# EAGLE schematic M3 (SN755410) (EAGLE 6.2)
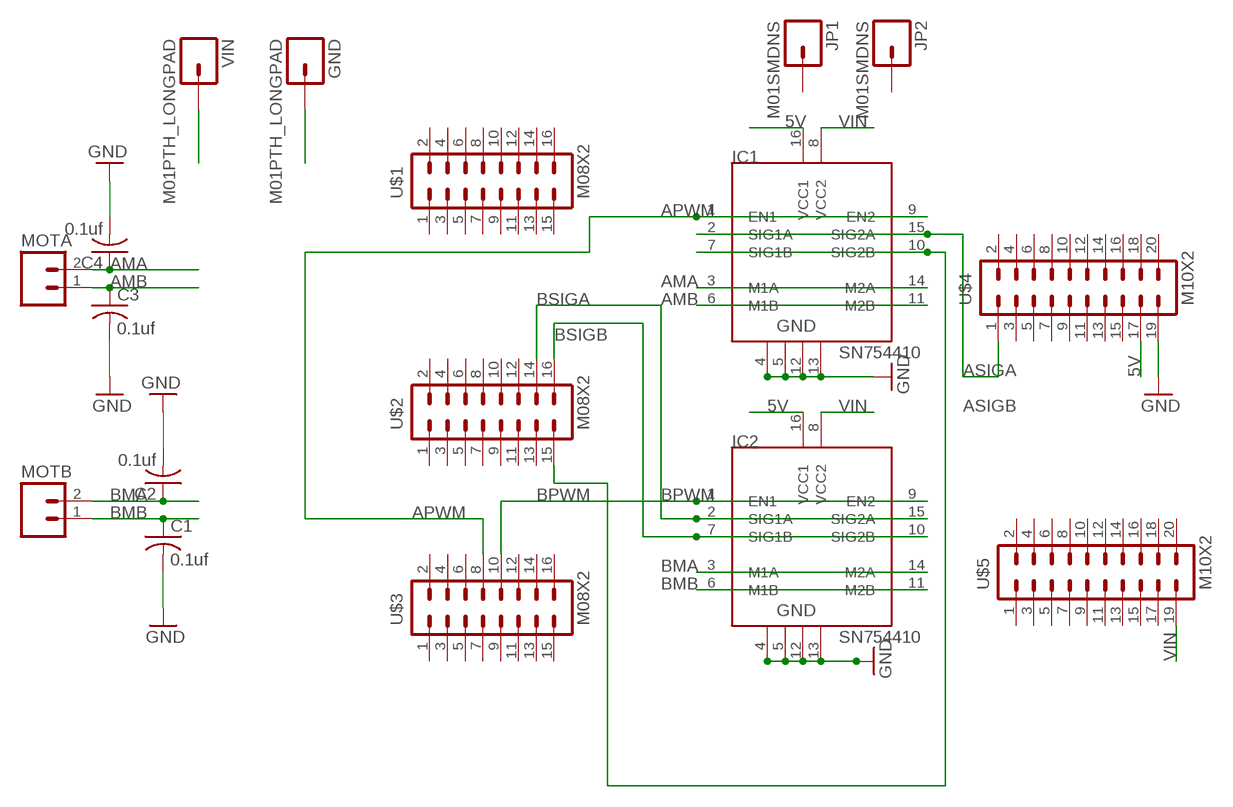
[diagram p0: schematic, sheet 1]

## Parts
C1  0.1uf  C-USC0805  [C0805]
C2  0.1uf  C-USC0805  [C0805]
C3  0.1uf  C-USC0805  [C0805]
C4  0.1uf  C-USC0805  [C0805]
GND  M01PTH_LONGPAD  [1X01_LONGPAD]
IC1  SN754410  [DIP16]
IC2  SN754410  [DIP16]
JP1  M01SMDNS  [1X01NS]
JP2  M01SMDNS  [1X01NS]
MOTA  M02PTH3  [1X02_LONGPADS]
MOTB  M02PTH3  [1X02_LONGPADS]
U$1  M08X2  [2X8]
U$2  M08X2  [2X8]
U$3  M08X2  [2X8]
U$4  M10X2  [2X10]
U$5  M10X2  [2X10]
VIN  M01PTH_LONGPAD  [1X01_LONGPAD]

## Nets
5V: IC1.16(VCC1) IC2.16(VCC1) U$4.17
AMA: C4.1 IC1.3(M1A) IC1.14(M2A) MOTA.2
AMB: C3.1 IC1.6(M1B) IC1.11(M2B) MOTA.1
APWM: IC1.1(EN1) IC1.9(EN2) U$3.8
ASIGA: IC1.2(SIG1A) IC1.15(SIG2A) U$4.1
ASIGB: IC1.7(SIG1B) IC1.10(SIG2B) U$2.15
BMA: C2.1 IC2.3(M1A) IC2.14(M2A) MOTB.2
BMB: C1.1 IC2.6(M1B) IC2.11(M2B) MOTB.1
BPWM: IC2.1(EN1) IC2.9(EN2) U$3.10
BSIGA: IC2.2(SIG1A) IC2.15(SIG2A) U$2.14
BSIGB: IC2.7(SIG1B) IC2.10(SIG2B) U$2.16
GND: C1.2 C2.2 C3.2 C4.2 GND.1 IC1.4 IC1.5 IC1.12 IC1.13 IC2.4 IC2.5 IC2.12 IC2.13 U$4.19
VIN: IC1.8(VCC2) IC2.8(VCC2) U$5.19 VIN.1
Unconnected: JP1.1 JP2.1 U$1.1 U$1.2 U$1.3 U$1.4 U$1.5 U$1.6 U$1.7 U$1.8 U$1.9 U$1.10 U$1.11 U$1.12 U$1.13 U$1.14 U$1.15 U$1.16 U$2.1 U$2.2 U$2.3 U$2.4 U$2.5 U$2.6 U$2.7 U$2.8 U$2.9 U$2.10 U$2.11 U$2.12 U$2.13 U$3.1 U$3.2 U$3.3 U$3.4 U$3.5 U$3.6 U$3.7 U$3.9 U$3.11 U$3.12 U$3.13 U$3.14 U$3.15 U$3.16 U$4.2 U$4.3 U$4.4 U$4.5 U$4.6 U$4.7 U$4.8 U$4.9 U$4.10 U$4.11 U$4.12 U$4.13 U$4.14 U$4.15 U$4.16 U$4.18 U$4.20 U$5.1 U$5.2 U$5.3 U$5.4 U$5.5 U$5.6 U$5.7 U$5.8 U$5.9 U$5.10 U$5.11 U$5.12 U$5.13 U$5.14 U$5.15 U$5.16 U$5.17 U$5.18 U$5.20

## Library data of the parts
C1-C4 = resistor:C-US: CAPACITOR, American symbol
GND JP1 JP2 VIN = SparkFun:M01: Header 1 Standard 1-pin 0.1" header. Use with straight break away headers (SKU : PRT-00116), right angle break away headers (PRT-00553), swiss pins (PRT-00743), machine pins (PRT-00117), and female headers (PRT-00115).
IC1 IC2 = HBridge:SN754410: Quadruple half-H driver
MOTA MOTB = SparkFun:M02: Header 2 Standard 2-pin 0.1" header. Use with straight break away headers (SKU : PRT-00116), right angle break away headers (PRT-00553), swiss pins (PRT-00743), machine pins (PRT-00117), and female headers (PRT-00115). Molex polarized connector foot print use with SKU : PRT-08233 with associated crimp pins and housings.
U$1-U$3 = SparkFun:M08X2
U$4 U$5 = SparkFun:M10X2: This was SPECIALLY designed to be used with our Graphic LCD Backpack. Be sure you want to use this! It is not only staggered on each line of header holes, but IT IS ALSO offset of the center point of the top and bottom lines by 5 mil. This causes the headers to lock into place on the "standard" footprint on the LCD screen. The extra squares on the tdocu layer are there simply to reference other pins (if you were to actually populate a longer header than ten long - this is what we do with the backpacks).